# EAGLE schematic source_eagle (EAGLE 9.6.2)
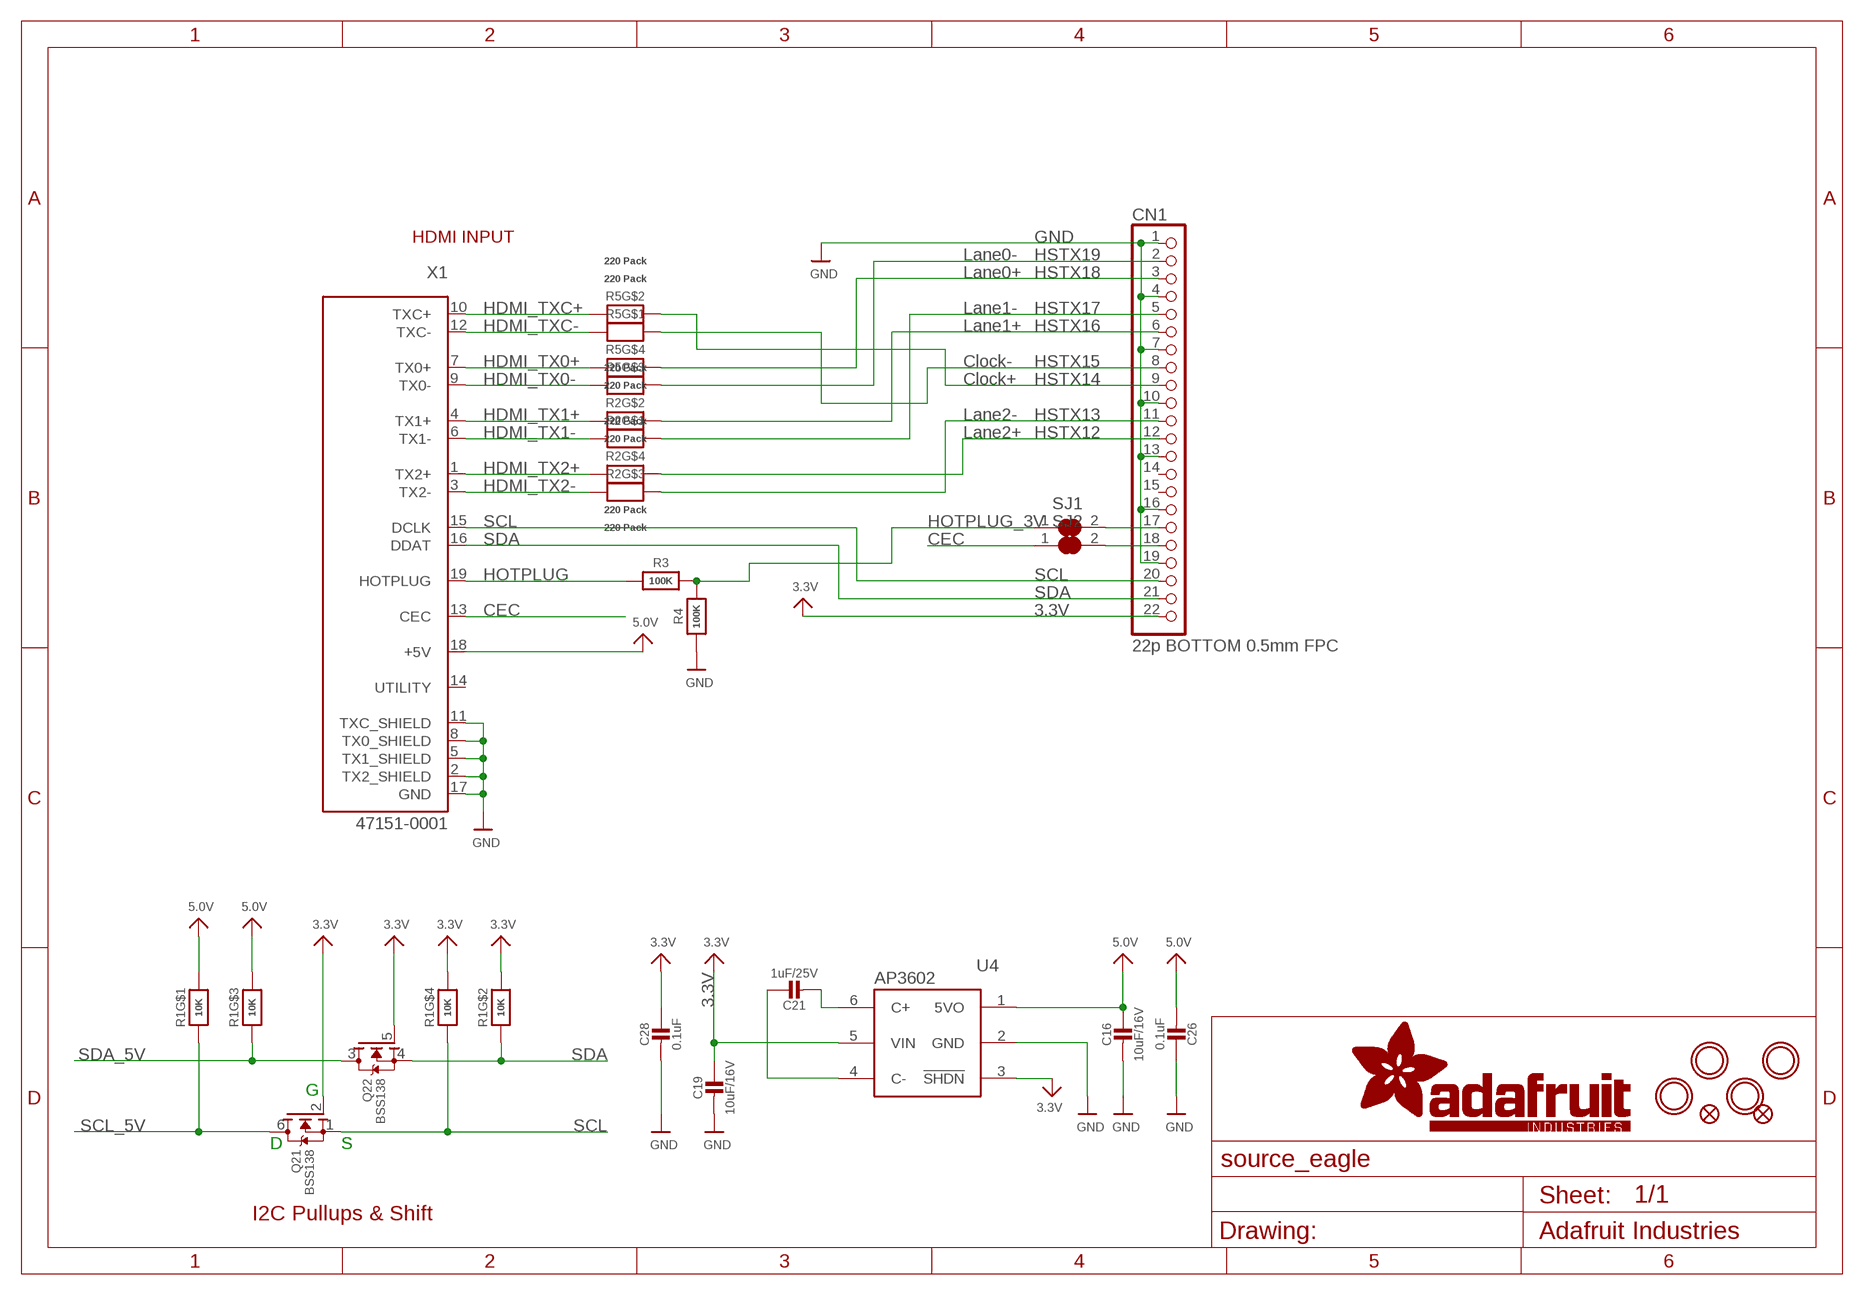
[diagram p0: schematic, sheet 1]

## Parts
C16  10uF/16V  CAP_CERAMIC0805-NOOUTLINE  [0805-NO]
C19  10uF/16V  CAP_CERAMIC0805-NOOUTLINE  [0805-NO]
C21  1uF/25V  CAP_CERAMIC0603_NO  [0603-NO]
C26  0.1uF  CAP_CERAMIC0603_NO  [0603-NO]
C28  0.1uF  CAP_CERAMIC0603_NO  [0603-NO]
CN1  22p BOTTOM 0.5mm FPC  HEADER-1X22_22PIN_0.5MM_BOT  [FPC_22PIN]
FID1  FIDUCIAL_1MM  [FIDUCIAL_1MM]
FID2  FIDUCIAL_1MM  [FIDUCIAL_1MM]
Q2  BSS138  MOSFET-N_DUAL  [SOT363]
R1  10K  RESISTOR_4PACK  [RESPACK_4X0603]
R2  220 Pack  RESISTOR_4PACK  [RESPACK_4X0603]
R3  100K  RESISTOR_0603_NOOUT  [0603-NO]
R4  100K  RESISTOR_0603_NOOUT  [0603-NO]
R5  220 Pack  RESISTOR_4PACK  [RESPACK_4X0603]
SJ1  SOLDERJUMPER_CLOSED  [SOLDERJUMPER_CLOSEDWIRE]
SJ2  SOLDERJUMPER_CLOSED  [SOLDERJUMPER_CLOSEDWIRE]
U4  AP3602  [SOT23-6]
U$2  MOUNTINGHOLE2.5  [MOUNTINGHOLE_2.5_PLATED]
U$3  MOUNTINGHOLE2.5  [MOUNTINGHOLE_2.5_PLATED]
U$5  MOUNTINGHOLE2.5  [MOUNTINGHOLE_2.5_PLATED]
U$7  MOUNTINGHOLE2.5  [MOUNTINGHOLE_2.5_PLATED]
X1  47151-0001  HDMI_MOLEX_47151  [HDMI_MOLEX_47151-0001]

## Nets
3.3V: C19.1 C28.1 CN1.22 Q2.2(1:G) Q2.5(2:G) R1.5 R1.7 U4.3(!SHDN) U4.5(VIN)
5.0V: C16.1 C26.2 R1.6 R1.8 U4.1(5VO) X1.18(+5V)
CEC: SJ2.1 X1.13(CEC)
GND: C16.2 C19.2 C26.1 C28.2 CN1.1 CN1.4 CN1.7 CN1.10 CN1.13 CN1.16 CN1.19 R4.1 U4.2(GND) X1.2(TX2_SHIELD) X1.5(TX1_SHIELD) X1.8(TX0_SHIELD) X1.11(TXC_SHIELD) X1.17(GND)
HDMI_TX0+: R5.4 X1.7(TX0+)
HDMI_TX0-: R5.3 X1.9(TX0-)
HDMI_TX1+: R2.2 X1.4(TX1+)
HDMI_TX1-: R2.1 X1.6(TX1-)
HDMI_TX2+: R2.4 X1.1(TX2+)
HDMI_TX2-: R2.3 X1.3(TX2-)
HDMI_TXC+: R5.2 X1.10(TXC+)
HDMI_TXC-: R5.1 X1.12(TXC-)
HOTPLUG: R3.1 X1.19(HOTPLUG)
HOTPLUG_3V: R3.2 R4.2 SJ1.1
HSTX12: CN1.12 R2.5
HSTX13: CN1.11 R2.6
HSTX14: CN1.9 R5.7
HSTX15: CN1.8 R5.8
HSTX16: CN1.6 R2.7
HSTX17: CN1.5 R2.8
HSTX18: CN1.3 R5.5
HSTX19: CN1.2 R5.6
N$1: CN1.17 SJ1.2
N$2: CN1.18 SJ2.2
N$8: C21.1 U4.4(C-)
N$9: C21.2 U4.6(C+)
SCL: CN1.20 Q2.1(1:S) R1.4 X1.15(DCLK)
SCL_5V: Q2.6(1:D) R1.1
SDA: CN1.21 Q2.4(2:S) R1.2 X1.16(DDAT)
SDA_5V: Q2.3(2:D) R1.3
Unconnected: CN1.14 CN1.15 X1.14(UTILITY)

## Notes on the sheet
- HDMI INPUT
- Lane0-
- Lane0+
- Lane1-
- Lane1+
- Clock-
- Clock+
- Lane2-
- Lane2+
- G
- D | S
- I2C Pullups & Shift

## Power pins joined to a net without a drawn wire
GND: X1.P$1(GND) X1.P$2(GND) X1.P$3(GND) X1.P$4(GND)

## Library data of the parts
C16 C19 C21 C26 C28 = microbuilder:CAP_CERAMIC: Ceramic Capacitors For new designs, use the packages preceded by an '_' character since they are more reliable: The following footprints should be used on most boards: _0402 - Standard footprint for regular board layouts _0603 - Standard footprint for regular board layouts _0805 - Standard footprint for regular board layouts _1206 - Standard footprint for regular board layouts For extremely tight-pitch boards where space is at a premium, the following 'micro-pitch' footprints can be used (smaller pads, no silkscreen outline, etc.): _0402MP - Micro-pitch footprint for very dense/compact boards _0603MP - Micro-pitch footprint for very dense/compact boards _0805MP - Micro-pitch footprint for very dense/compact boards _1206MP - Micro-pitch footprint for very dense/compact boards
CN1 = adafruit_electromech:HEADER-1X22
FID1 FID2 = microbuilder:FIDUCIAL: Fiducial Alignment Points Various fiducial points for machine vision alignment.; BOM: EXCLUDE
Q2 = microbuilder:MOSFET-N_DUAL: Dual N-Channel MOSFET SOT363 (2.0x1.25mm) 2N7002PS - 60V, 320mA [Digikey: 568-5984-1-ND]; JLC_ROTATION: 270
R1 R2 R5 = microbuilder:RESISTOR_4PACK: Resistor Packs (4 resistors) 4 x 0603 10K 1/16W - Digikey: YC164J-10KCT-ND
R3 R4 = microbuilder:RESISTOR: Resistors For new designs, use the packages preceded by an '_' character since they are more reliable: The following footprints should be used on most boards: _0402 - Standard footprint for regular board layouts _0603 - Standard footprint for regular board layouts _0805 - Standard footprint for regular board layouts _1206 - Standard footprint for regular board layouts For extremely tight-pitch boards where space is at a premium, the following 'micro-pitch' footprints can be used (smaller pads, no silkscreen outline, etc.): _0402MP - Micro-pitch footprint for very dense/compact boards _0603MP - Micro-pitch footprint for very dense/compact boards _0805MP - Micro-pitch footprint for very dense/compact boards _1206MP - Micro-pitch footprint for very dense/compact boards
SJ1 SJ2 = microbuilder:SOLDERJUMPER_CLOSED: Solder Jumper - Closed These solder jumpers are closed by default CLOSEDWIRE - 10 mil trace between pads that can be cut and resoldered later CLOSEDPERM - 63 mil trace between pads for a permanent connection (used to 'bridge' two signals, a shameless hack for Eagle). Can double as a test point as well (no cream layer)
U4 = microbuilder:AP3602
U$2 U$3 U$5 U$7 = adafruit_electromech:MOUNTINGHOLE: Mounting Hole For #2 screws (0.086"/2.18mm width, 0.094"/2.4mm hole) use 2.5mm; BOM: EXCLUDE
X1 = adafruit_electromech:HDMI_MOLEX_47151: The default footprint uses layer 46 (Milling) for the tabs, the DIMLAYER footprint uses layer 20 (Dimensions). Both will probably require special instructions to the board house; LCSC: C138388

## Net classes
1 power: width 0.305 mm, drill 0.381 mm